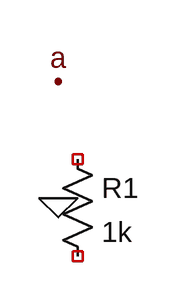
[diagram p0: schematic unknown_record.asc]
unknown_record.asc, the LTspice schematic file:
Version 4
SHEET 1 880 680
FLAG 96 96 a
FLAG 96 192 0
NOSUCHRECORD 96 96
SYMBOL res 96 144 R0
SYMATTR InstName R1
SYMATTR Value 1k

The netlist it stands for:
* unknown_record.asc
R1 NC_01 NC_02 1k
.backanno
.end